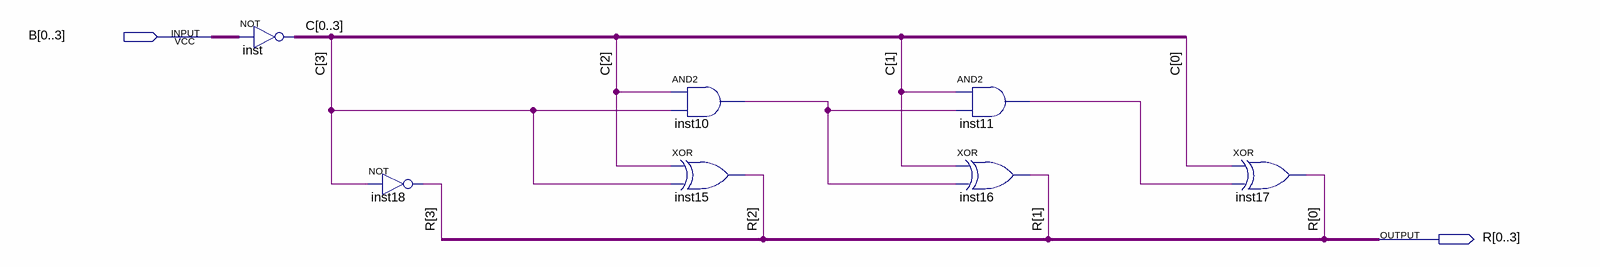
[diagram p0: schematic sheet]
// Quartus schematic comp_a_2.bdf as structural Verilog: 7 symbols, 2 pins
module comp_a_2 (
  input  [0:3] B,
  output [0:3] R
);

  wire inst10_out, inst11_out;
  wire [3:0] C;

  assign {C[0], C[1], C[2], C[3]} = ~B;  // NOT inst, 4 bits wide
  not inst18 (R[3], C[3]);
  and inst10 (inst10_out, C[2], C[3]);
  xor inst15 (R[2], C[2], C[3]);
  and inst11 (inst11_out, C[1], inst10_out);
  xor inst16 (R[1], C[1], inst10_out);
  xor inst17 (R[0], C[0], inst11_out);
endmodule
